# EAGLE design Waterbotboard (EAGLE 9.2.2)
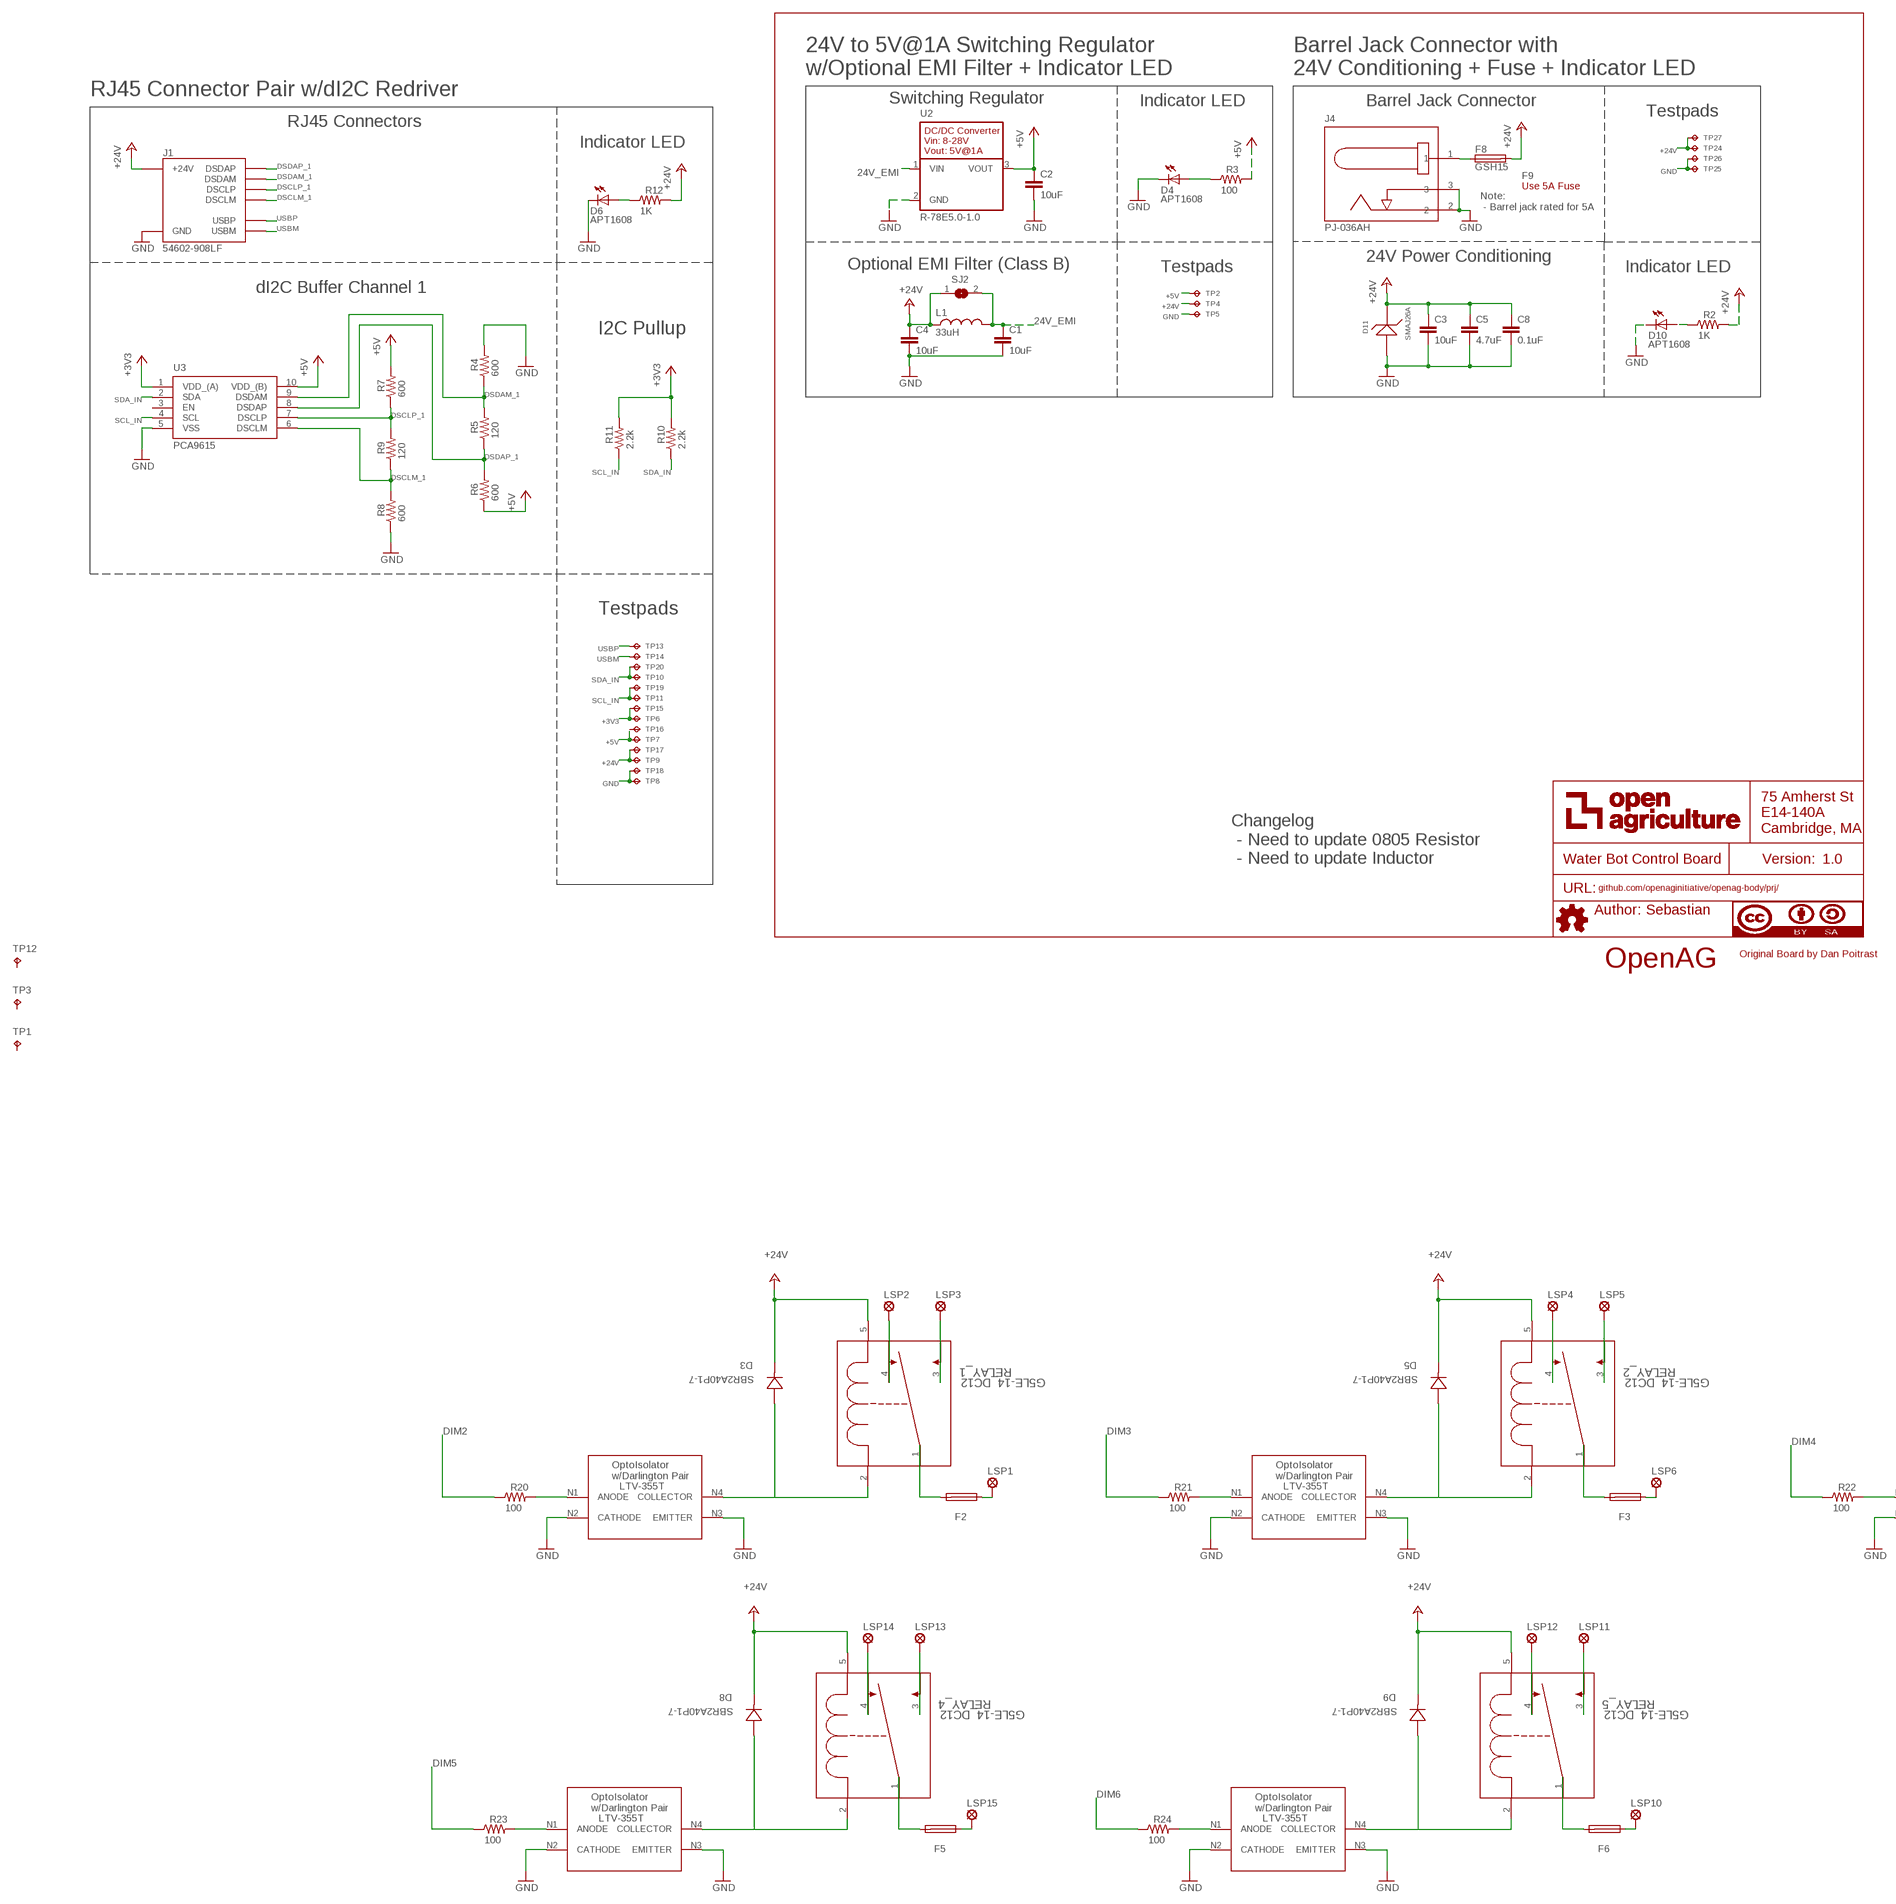
[diagram p0: schematic, sheet 1, part 1 of 2]
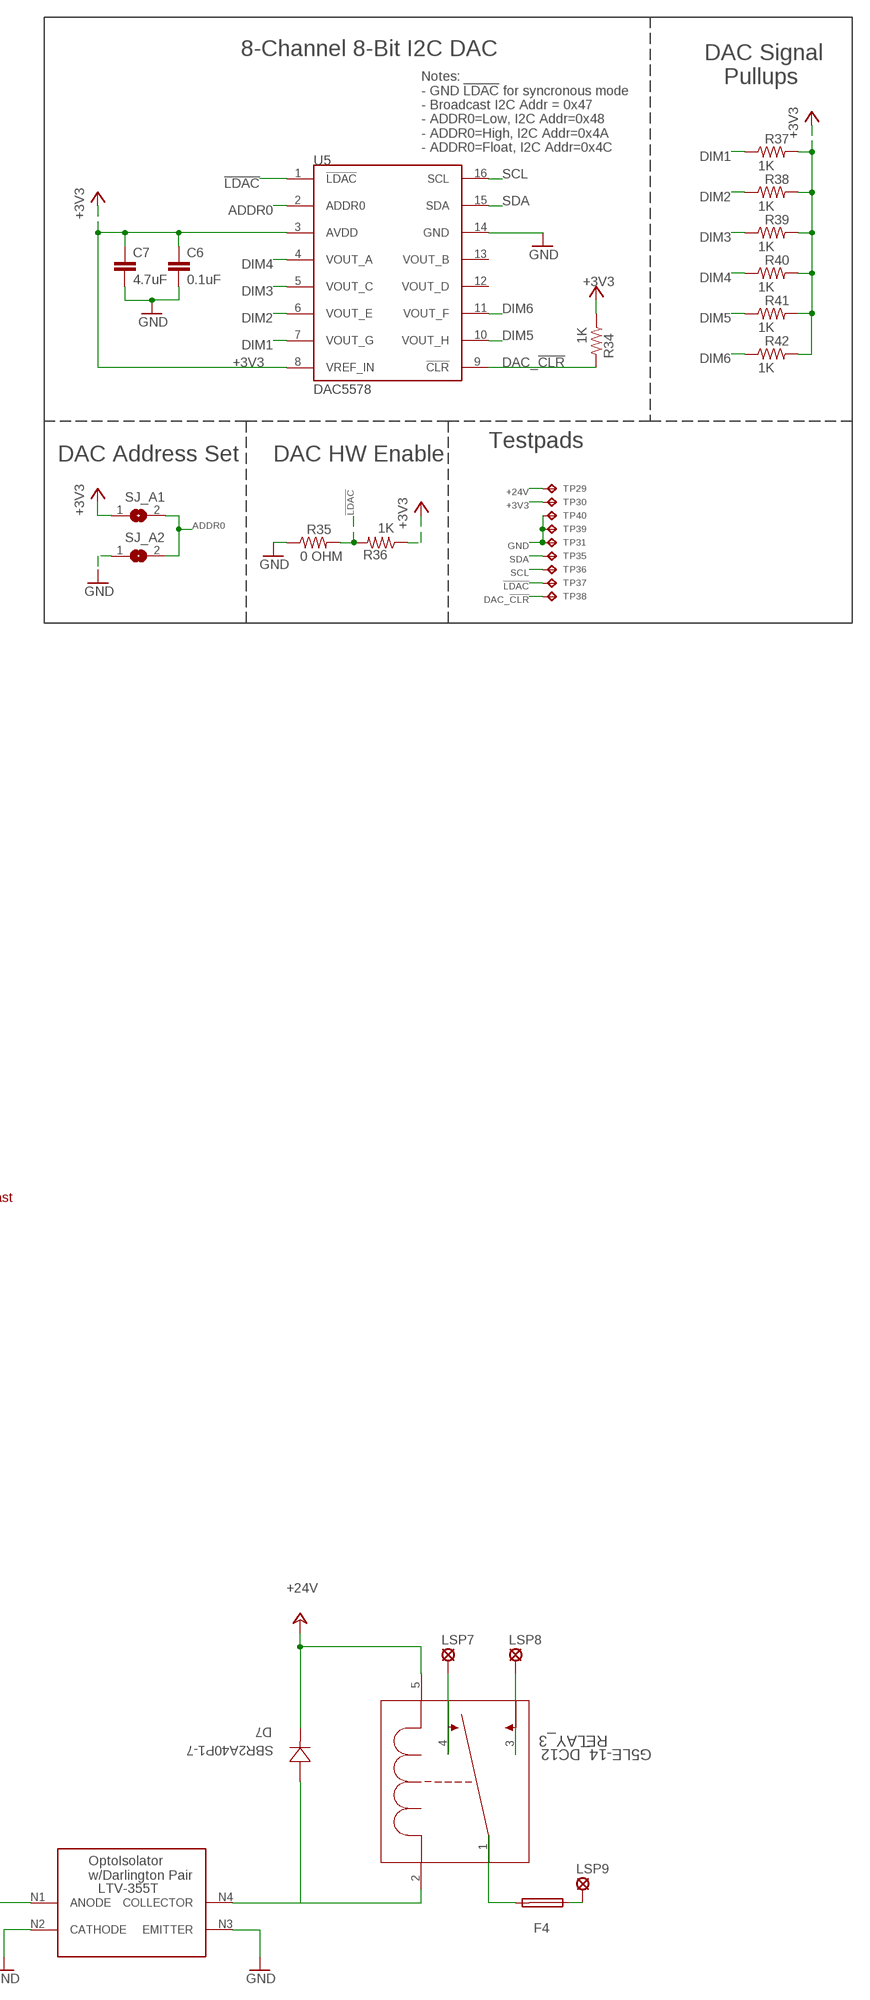
[diagram p1: schematic, sheet 1, part 2 of 2]

## Parts
C1  10uF  10UF-GMK212BBJ106KG-T  [C0805]
C2  10uF  10UF-GMK212BBJ106KG-T  [C0805]
C3  10uF  10UF-GMK212BBJ106KG-T  [C0805]
C4  10uF  10UF-GMK212BBJ106KG-T  [C0805]
C5  4.7uF  4.7UF-CL21A475KBQNNNE  [C0805]
C6  0.1uF  0.1UF-C0603C104K5RACTU  [C0603]
C7  4.7uF  4.7UF-CL21A475KBQNNNE  [C0805]
C8  0.1uF  0.1UF-C0603C104K5RACTU  [C0603]
D3  SBR2A40P1-7  [POWERDI123]
D4  APT1608  APT1608CGCK  [CHIPLED_0603]
D5  SBR2A40P1-7  [POWERDI123]
D6  APT1608  APT1608CGCK  [CHIPLED_0603]
D7  SBR2A40P1-7  [POWERDI123]
D8  SBR2A40P1-7  [POWERDI123]
D9  SBR2A40P1-7  [POWERDI123]
D10  APT1608  APT1608CGCK  [CHIPLED_0603]
D11  SMAJ26A  SMAJ26A-13-F  [SMA]
F2  GSH15  [GSH15]
F3  GSH15  [GSH15]
F4  GSH15  [GSH15]
F5  GSH15  [GSH15]
F6  GSH15  [GSH15]
F8  GSH15  [GSH15]
F9  Use 5A Fuse  0217005.MXP  [FUSE-CARTRIDGE]
J1  54602-908LF  RJ45-DI2C-USB-54602-908LFPTH  [RJ45-DI2C-USB-54602-908LF]
J4  PJ-036AH  BARREL-JACK-PJ-036AH-SMT-TR  [BARREL-JACK-PJ-036AH]
L1  33uH  33UH-29333C  [29333C]
LSP1  LSP13  [LSP13]
LSP2  LSP13  [LSP13]
LSP3  LSP13  [LSP13]
LSP4  LSP13  [LSP13]
LSP5  LSP13  [LSP13]
LSP6  LSP13  [LSP13]
LSP7  LSP13  [LSP13]
LSP8  LSP13  [LSP13]
LSP9  LSP13  [LSP13]
LSP10  LSP13  [LSP13]
LSP11  LSP13  [LSP13]
LSP12  LSP13  [LSP13]
LSP13  LSP13  [LSP13]
LSP14  LSP13  [LSP13]
LSP15  LSP13  [LSP13]
R2  1K  1K-ERJ-PB3D1001V  [RC0603N]
R3  100  100OHM-RC0603JR-07100RL  [RC0603N]
R4  600  600OHM-RC0603FR-07604RL  [RC0603N]
R5  120  120OHM-RC0603FR-07120RL  [RC0603N]
R6  600  600OHM-RC0603FR-07604RL  [RC0603N]
R7  600  600OHM-RC0603FR-07604RL  [RC0603N]
R8  600  600OHM-RC0603FR-07604RL  [RC0603N]
R9  120  120OHM-RC0603FR-07120RL  [RC0603N]
R10  2.2k  2.2K-RC0603JR-072K2L  [RC0603N]
R11  2.2k  2.2K-RC0603JR-072K2L  [RC0603N]
R12  1K  1K-ERJ-PB3D1001V  [RC0603N]
R20  100  100OHM-RC0603JR-07100RL  [RC0603N]
R21  100  100OHM-RC0603JR-07100RL  [RC0603N]
R22  100  100OHM-RC0603JR-07100RL  [RC0603N]
R23  100  100OHM-RC0603JR-07100RL  [RC0603N]
R24  100  100OHM-RC0603JR-07100RL  [RC0603N]
R34  1K  1K-ERJ-PB3D1001V  [RC0603N]
R35  0 OHM  0OHM-RC0603JR-070RL  [RC0603N]
R36  1K  1K-ERJ-PB3D1001V  [RC0603N]
R37  1K  1K-ERJ-PB3D1001V  [RC0603N]
R38  1K  1K-ERJ-PB3D1001V  [RC0603N]
R39  1K  1K-ERJ-PB3D1001V  [RC0603N]
R40  1K  1K-ERJ-PB3D1001V  [RC0603N]
R41  1K  1K-ERJ-PB3D1001V  [RC0603N]
R42  1K  1K-ERJ-PB3D1001V  [RC0603N]
RELAY_1  G5LE-14_DC12  [RELAY_G5LE-1]
RELAY_2  G5LE-14_DC12  [RELAY_G5LE-1]
RELAY_3  G5LE-14_DC12  [RELAY_G5LE-1]
RELAY_4  G5LE-14_DC12  [RELAY_G5LE-1]
RELAY_5  G5LE-14_DC12  [RELAY_G5LE-1]
SJ2  EMI-BYPASS  [EMI-BYPASS]
SJ_A1  SOLDERJUMPERREFLOW_NOPASTE  [SJ1]
SJ_A2  SOLDERJUMPERREFLOW_NOPASTE  [SJ1]
TP1  TPB2,54  [B2,54]
TP2  TPTP06R  [TP06R]
TP3  TPB2,54  [B2,54]
TP4  TPTP06R  [TP06R]
TP5  TPTP06R  [TP06R]
TP6  TPTP04R  [TP04R]
TP7  TPTP04R  [TP04R]
TP8  TPTP04R  [TP04R]
TP9  TPTP04R  [TP04R]
TP10  TPTP04R  [TP04R]
TP11  TPTP04R  [TP04R]
TP12  TPB2,54  [B2,54]
TP13  TPTP04R  [TP04R]
TP14  TPTP04R  [TP04R]
TP15  TPTP04R  [TP04R]
TP16  TPTP04R  [TP04R]
TP17  TPTP04R  [TP04R]
TP18  TPTP04R  [TP04R]
TP19  TPTP04R  [TP04R]
TP20  TPTP04R  [TP04R]
TP24  TPTP04R  [TP04R]
TP25  TPTP04R  [TP04R]
TP26  TPTP04R  [TP04R]
TP27  TPTP04R  [TP04R]
TP29  TPTP04R  [TP04R]
TP30  TPTP04R  [TP04R]
TP31  TPTP04R  [TP04R]
TP35  TPTP04R  [TP04R]
TP36  TPTP04R  [TP04R]
TP37  TPTP04R  [TP04R]
TP38  TPTP04R  [TP04R]
TP39  TPTP04R  [TP04R]
TP40  TPTP04R  [TP04R]
U2  R-78E5.0-1.0  [R-78E5.0-1.0]
U3  PCA9615  PCA9615DPJ  [SOP50P490X110-10N]
U5  DAC5578  DAC5578SPW  [TSSOP16]
U$6  AUTHOR  [AUTHOR]
U$7  TITLE  [TITLE]
U$10  LTV-355T  [LTV-355T]
U$11  LTV-355T  [LTV-355T]
U$12  LTV-355T  [LTV-355T]
U$13  LTV-355T  [LTV-355T]
U$14  LTV-355T  [LTV-355T]

## Nets
24V_EMI: C1.1 L1.2 SJ2.2 U2.1(VIN)
24V_IN1: F8.1 J4.1
!LDAC!: R35.2 R36.2 TP37.1(TP) U5.1(!LDAC!)
+3V3: C6.1 C7.1 R10.2 R11.2 R34.1 R36.1 R37.2 R38.2 R39.2 R40.2 R41.2 R42.2 SJ_A1.1 TP6.1(TP) TP15.1(TP) TP30.1(TP) U3.1(VDD_(A)) U5.3(AVDD) U5.8(VREF_IN)
+5V: C2.1 R3.2 R6.1 R7.2 TP2.TP TP7.1(TP) TP16.1(TP) U2.3(VOUT) U3.10(VDD_(B))
+24V: C3.1 C4.1 C5.1 C8.1 D3.- D5.- D7.- D8.- D9.- D11.1 F8.2 J1.24V(6)(+24V) L1.1 R2.2 R12.2 RELAY_1.5 RELAY_2.5 RELAY_3.5 RELAY_4.5 RELAY_5.5 SJ2.1 TP4.TP TP9.1(TP) TP17.1(TP) TP24.1(TP) TP27.1(TP) TP29.1(TP)
ADDR0: SJ_A1.2 SJ_A2.2 U5.2(ADDR0)
DAC_!CLR!: R34.2 TP38.1(TP) U5.9(!CLR!)
DIM1: R37.1 U5.7(VOUT_G)
DIM2: R20.1 R38.1 U5.6(VOUT_E)
DIM3: R21.1 R39.1 U5.5(VOUT_C)
DIM4: R22.1 R40.1 U5.4(VOUT_A)
DIM5: R23.1 R41.1 U5.10(VOUT_H)
DIM6: R24.1 R42.1 U5.11(VOUT_F)
DSCLM_1: J1.DSCLM(5)(DSCLM) R8.2 R9.1 U3.6(DSCLM)
DSCLP_1: J1.DSCLP(4)(DSCLP) R7.1 R9.2 U3.7(DSCLP)
DSDAM_1: J1.DSDAM(2)(DSDAM) R4.1 R5.2 U3.9(DSDAM)
DSDAP_1: J1.DSDAP(1)(DSDAP) R5.1 R6.2 U3.8(DSDAP)
GND: C1.2 C2.2 C3.2 C4.2 C5.2 C6.2 C7.2 C8.2 D4.C D6.C D10.C D11.2 J1.GND(3)(GND) J4.2 J4.3 R4.2 R8.1 R35.1 SJ_A2.1 TP5.TP TP8.1(TP) TP18.1(TP) TP25.1(TP) TP26.1(TP) TP31.1(TP) TP39.1(TP) TP40.1(TP) U2.2(GND) U3.5(VSS) U5.14(GND) U$10.N2(CATHODE) U$10.N3(EMITTER) U$11.N2(CATHODE) U$11.N3(EMITTER) U$12.N2(CATHODE) U$12.N3(EMITTER) U$13.N2(CATHODE) U$13.N3(EMITTER) U$14.N2(CATHODE) U$14.N3(EMITTER)
N$4: F2.1 LSP1.MP
N$5: F5.1 LSP15.MP
N$6: F6.1 LSP10.MP
N$7: F3.1 LSP6.MP
N$11: F4.1 LSP9.MP
N$27: LSP2.MP RELAY_1.4
N$31: LSP4.MP RELAY_2.4
N$32: LSP7.MP RELAY_3.4
N$33: D4.A R3.1
N$42: D3.+ RELAY_1.2 U$10.N4(COLLECTOR)
N$43: D6.A R12.1
N$44: F2.2 RELAY_1.1
N$45: LSP3.MP RELAY_1.3
N$46: LSP12.MP RELAY_5.4
N$47: R20.2 U$10.N1(ANODE)
N$48: D5.+ RELAY_2.2 U$11.N4(COLLECTOR)
N$49: F3.2 RELAY_2.1
N$50: LSP5.MP RELAY_2.3
N$51: LSP14.MP RELAY_4.4
N$52: R21.2 U$11.N1(ANODE)
N$53: D7.+ RELAY_3.2 U$12.N4(COLLECTOR)
N$54: F4.2 RELAY_3.1
N$55: LSP8.MP RELAY_3.3
N$57: R22.2 U$12.N1(ANODE)
N$58: D8.+ RELAY_4.2 U$13.N4(COLLECTOR)
N$59: F5.2 RELAY_4.1
N$60: LSP13.MP RELAY_4.3
N$61: D10.A R2.1
N$62: R23.2 U$13.N1(ANODE)
N$63: D9.+ RELAY_5.2 U$14.N4(COLLECTOR)
N$64: F6.2 RELAY_5.1
N$65: LSP11.MP RELAY_5.3
N$67: R24.2 U$14.N1(ANODE)
SCL: TP36.1(TP) U5.16(SCL)
SCL_IN: R11.1 TP11.1(TP) TP19.1(TP) U3.4(SCL)
SDA: TP35.1(TP) U5.15(SDA)
SDA_IN: R10.1 TP10.1(TP) TP20.1(TP) U3.2(SDA)
USBM: J1.USBM(8)(USBM) TP14.1(TP)
USBP: J1.USBP(7)(USBP) TP13.1(TP)
Unconnected: TP1.TP TP3.TP TP12.TP U3.3(EN) U5.12(VOUT_D) U5.13(VOUT_B)

## Notes on the sheet
- 8-Channel 8-Bit I2C DAC
- 24V to 5V@1A Switching Regulator
  w/Optional EMI Filter + Indicator LED
- Barrel Jack Connector with
  24V Conditioning + Fuse + Indicator LED
- RJ45 Connector Pair w/dI2C Redriver
- DAC Signal 
     Pullups
- Switching Regulator | Indicator LED | Barrel Jack Connector
- Testpads
- RJ45 Connectors
- Indicator LED
- Notes:
  - GND !LDAC! for syncronous mode
  - Broadcast I2C Addr = 0x47
  - ADDR0=Low, I2C Addr=0x48
  - ADDR0=High, I2C Addr=0x4A
  - ADDR0=Float, I2C Addr=0x4C
- Note:
   - Barrel jack rated for 5A
- 24V Power Conditioning
- Optional EMI Filter (Class B) | Testpads | Indicator LED
- dI2C Buffer Channel 1
- I2C Pullup
- Testpads
- DAC Address Set | DAC HW Enable
- Testpads
- Changelog
   - Need to update 0805 Resistor
   - Need to update Inductor
- Original Board by Dan Poitrast
- OpenAG
- LTV-355T | LTV-355T | LTV-355T
- LTV-355T | LTV-355T

## Library data of the parts
C1-C4 = openag-capacitors:10UF-GMK212BBJ106KG-T: CAP CER 10UF 35V X5R 0805 Description: 10µF ±10% 35V Ceramic Capacitor X5R 0805 (2012 Metric) Technical Specifications: Capacitance: 10µF Tolerance: ±10% Rated Voltage: 35V Temperature Coefficient: X5R Operating Temperature: -55°C ~ 85°C Package / Case: 0805 (2012 Metric) Datasheet(s): GMK212BBJ106KG-T Spec <http://ds.yuden.co.jp/TYCOMPAS/ut/detail.do?productNo=GMK212BBJ106KG-T&fileName=GMK212BBJ106KG-T_SS&mode=specSheetDownload> Vendor(s): Digikey: 587-4893-1-ND <https://www.digikey.com/product-detail/en/taiyo-yuden/GMK212BBJ106KG-T/587-4893-1-ND/6563736>; MANUFACTURER: Taiyo Yuden; MPN: GMK212BBJ106KG-T; VENDOR: Digikey; VLINK: https://www.digikey.com/product-detail/en/taiyo-yuden/GMK212BBJ106KG-T/587-4893-1-ND/6563736; VPN: 587-4893-1-ND
C5 C7 = openag-capacitors:4.7UF-CL21A475KBQNNNE: CAP CER 4.7UF 50V X5R 0805 Description: 4.7µF ±10% 50V Ceramic Capacitor X5R 0805 (2012 Metric) Technical Specifications: Capacitance: 4.7uF Tolerance: ±10% Rated Voltage: 50V Temperature Coefficient: X5R Operating Temperature: -55°C ~ 85°C Package/Case: 0805 (2012 Metric) Datasheet(s): CL21A475KBQNNNE Characteristics <http://www.samsungsem.com/kr/front/downloadcms.do?path=/kr/support/product-search/mlcc/__icsFiles/afieldfile/2014/11/05&fileName=C_CL21A475KBQNNNE.pdf> Vendor(s): Digikey: 1276-1248-1-ND <https://www.digikey.com/product-detail/en/samsung-electro-mechanics/CL21A475KBQNNNE/1276-1248-1-ND/3889334>; MANUFACTURER: Samsung; MPN: CL21A475KBQNNNE; VENDOR: Digikey; VLINK: https://www.digikey.com/product-detail/en/samsung-electro-mechanics/CL21A475KBQNNNE/1276-1248-1-ND/3889334; VPN: 1276-1248-1-ND
C6 C8 = openag-capacitors:0.1UF-C0603C104K5RACTU: CAP CER 0.1UF 50V X7R 0603 Description: 0.1µF ±10% 50V Ceramic Capacitor X7R 0603 (1608 Metric) Technical Specifications: Capacitance: 0.1µF Tolerance: ±10% Rated Voltage: 50V Temperature Coefficient: X7R Operating Temperature: -55°C ~ 125°C Package / Case: 0603 (1608 Metric) Datasheet(s): X7R Dielectric, 6.3-250 VDC <https://search.kemet.com/component-edge/download/datasheet/C0603C104K5RACTU.pdf> Vendor(s): Digikey: 399-5089-1-ND <https://www.digikey.com/product-detail/en/kemet/C0603C104K5RACTU/399-5089-1-ND/1465623>; MANUFACTURER: Kemet; MPN: C0603C104K5RACTU; VENDOR: Digikey; VLINK: https://www.digikey.com/product-detail/en/kemet/C0603C104K5RACTU/399-5089-1-ND/1465623; VPN: 399-5089-1-ND
D3 D5 D7-D9 = openag-diodes:SBR2A40P1-7: DIODE SBR 40V 2A POWERDI123 Description: Diode Super Barrier 40V 2A Surface Mount PowerDI™ 123 Technical Specifications: Diode Type: Super Barrier Voltage - DC Reverse (Vr) (Max): 40V Current - Average Rectified (Io): 2A Voltage - Forward (Vf) (Max) @ If: 500mV @ 2A Speed: Standard Recovery >500ns, > 200mA (Io) Current - Reverse Leakage @ Vr: 100µA @ 40V Mounting Type: Surface Mount Package / Case: POWERDI®123 Supplier Device Package: PowerDI™ 123 Operating Temperature - Junction: -65°C ~ 150°C Base Part Number: SBR2A40 Datasheet(s): SBR2A40P1 <https://www.diodes.com/assets/Datasheets/SBR2A40P1.pdf> Vendor(s): Digikey: SBR2A40P1DITR-ND <https://www.digikey.com/product-detail/en/diodes-incorporated/SBR2A40P1-7/SBR2A40P1DITR-ND/1681825>; MANUFACTURER: Diodes Incorporated; MPN: SBR2A40P1-7; VENDOR: Digikey; VLINK: https://www.digikey.com/product-detail/en/diodes-incorporated/SBR2A40P1-7/SBR2A40P1DITR-ND/1681825; VPN: SBR2A40P1DITR-ND
D4 D6 D10 = openag-diodes:APT1608CGCK: LED GREEN CLEAR 0603 SMD Description: Green 570nm LED Indication - Discrete 2.1V 0603 (1608 Metric) Technical Specifications: Color: Green Lens Color: Colorless Lens Transparency: Clear Millicandela Rating: 50mcd Lens Style/Size: Rectangle with Flat Top, 1.20mm x 0.80mm Voltage - Forward (Vf) (Typ): 2.1V Current - Test: 20mA Viewing Angle: 120° Mounting Type: Surface Mount Wavelength - Dominant: 570nm Wavelength - Peak: 574nm Package / Case: 0603 (1608 Metric) Supplier Device Package: Chip LED Size / Dimension: 1.60mm L x 0.80mm W Height (Max): 0.75mm Datasheet(s): APT1608CGCK <http://www.kingbrightusa.com/images/catalog/SPEC/APT1608CGCK.pdf> Vendor(s): Digikey: 754-1116-1-ND <https://www.digikey.com/product-detail/en/kingbright/APT1608CGCK/754-1116-1-ND/1747833#>; MANUFACTURER: Kingbright; MPN: APT1608CGCK; VENDOR: Digikey; VLINK: https://www.digikey.com/product-detail/en/kingbright/APT1608CGCK/754-1116-1-ND/1747833#; VPN: 754-1116-1-ND
D11 = openag-diodes:SMAJ26A-13-F: TVS DIODE 26VWM 42.1VC SMA Description: TVS DIODE 26VWM 42.1VC SMA Technical Specifications: Type: Zener Voltage - Reverse Standoff (Typ): 26V Voltage - Breakdown (Min): 28.9V Voltage - Clamping (Max) @ Ipp: 42.1V Current - Peak Pulse (10/1000µs): 9.5A Power - Peak Pulse: 400W Power Line Protection: No Operating Temperature: -55°C ~ 150°C (TJ) DO-214AC, SMA Datasheet(s): SMAJ5.0(C)A - SMAJ200(C)A Vendor(s): Digikey: SMAJ26A-FDICT-ND <https://www.digikey.com/product-detail/en/diodes-incorporated/SMAJ26A-13-F/SMAJ26A-FDICT-ND/806583>; MANUFACTURER: Diodes Incorporated; MPN: SMAJ26A-13-F; VENDOR: Digikey; VLINK: https://www.digikey.com/product-detail/en/diodes-incorporated/SMAJ26A-13-F/SMAJ26A-FDICT-ND/806583; VPN: SMAJ26A-FDICT-ND
F2-F6 = fuse:GSH15: FUSE HOLDER grid 15mm, 19649 Wickmann; MPN: 64900001039; OC_FARNELL: 1271673; OC_NEWARK: 02P0318
F8 = openag-fuses:GSH15: FUSE BLOCK CART 250V 6.3A PCB Description: Fuse Block 6.3A 250V 1 Circuit Cartridge PCB Technical Specifications: Fuseholder Type: Block Fuse Type: Cartridge For Use With/Related Products: 5mm x 20mm Fuse Size: 5mm x 20mm Number of Circuits: 1 Voltage: 250V Current Rating: 6.3A Mounting Type: PCB Orientation: Horizontal Termination Style: PC Pin Contact Material: Copper Alloy Contact Finish: Tin Datasheet(s): 649 Series <http://www.littelfuse.com/~/media/electronics/datasheets/fuse_blocks/littelfuse_fuse_block_649_datasheet.pdf.pdf> Vendor(s): Digikey: WK0011-ND <https://www.digikey.com/product-detail/en/littelfuse-inc/64900001039/WK0011-ND/245470>; MANUFACTURER: Littelfuse Inc.; MPN: 64900001039; VENDOR: Digikey; VLINK: https://www.digikey.com/product-detail/en/littelfuse-inc/64900001039/WK0011-ND/245470; VPN: WK0011-ND
F9 = openag-fuses:0217005.MXP: FUSE GLASS 5A 250VAC 5X20MM Description: FUSE GLASS 5A 250VAC 5X20MM Technical Specifications: Fuse Type: Cartridge, Glass Current Rating: 5A Voltage Rating - AC: 250V Response Time: Fast Package / Case: 5mm x 20mm Mounting Type: Holder Breaking Capacity @ Rated Voltage: 50A Melting I²t: 42.795 Approvals: BSI, CE, CCC, CSA, KC, PSE, SEMKO, UR, VDE Operating Temperature: -55°C ~ 125°C Size / Dimension: 0.205" Dia x 0.787" L (5.20mm x 20.00mm) DC Cold Resistance: 0.0137 Ohms Datasheet(s): 217 Series Datasheet <http://www.littelfuse.com/~/media/electronics/datasheets/fuses/littelfuse_fuse_217_datasheet.pdf.pdf> Vendor(s): Digikey: F1725-ND <https://www.digikey.com/product-detail/en/littelfuse-inc/0217005.MXP/F1725-ND/777549#>; MANUFACTURER: Littelfuse Inc.; MPN: 0217005.MXP; VENDOR: Digikey; VLINK: https://www.digikey.com/product-detail/en/littelfuse-inc/0217005.MXP/F1725-ND/777549; VPN: F1725-ND
J1 = openag-connectors:RJ45-DI2C-USB-54602-908LF: CONN MOD JACK 8P8C R/A UNSHLD Description: Jack Modular Connector 8p8c (RJ45, Ethernet) 90° Angle (Right) Unshielded Cat3 Technical Specifications: Connector Type: Jack Number of Positions/Contacts: 8p8c (RJ45, Ethernet) Number of Ports: 1 Number of Rows: 1 Mounting Type: Through Hole Orientation: 90° Angle (Right) Termination: Solder Shielding: Unshielded Ratings: Cat3 Features: Board Lock LED Color: Does Not Contain LED Tab Direction: Down Contact Material: Copper Alloy Contact Finish: Gold Contact Finish Thickness: 15µin (0.38µm) Housing Material: Polyester, Glass Filled Operating Temperature: -40°C ~ 70°C Datasheet(s): 54601-x04(zzz)WPLF Drawing <http://cdn.amphenol-icc.com/media/wysiwyg/files/drawing/c-bmj-0102.pdf> Vendor(s): Digikey: 609-1046-ND <https://www.digikey.com/product-detail/en/amphenol-fci/54602-908LF/609-1046-ND/1001360>; MANUFACTURER: Amphenol FCI; MPN: 54602-908LF; VENDOR: Digikey; VLINK: https://www.digikey.com/product-detail/en/amphenol-fci/54602-908LF/609-1046-ND/1001360; VPN: 609-1046-ND
J4 = openag-connectors:BARREL-JACK-PJ-036AH-SMT-TR: CONN PWR JACK 2X5.5MM SOLDER Description: Power Barrel Connector Jack 2.10mm ID (0.083"), 5.50mm OD (0.217") Surface Mount, Right Angle Technical Specifications: Connector Type: Jack Gender: Male Industry Recognized Mating Diameter: 2.10mm ID (0.083"), 5.50mm OD (0.217") Actual Diameter: 0.078" (2.00mm ID), 0.248" (6.30mm OD) Number of Positions/Contacts: 2 Conductors, 3 Contacts Internal Switch(s): Single Switch, Normally Closed Mounting Type: Surface Mount, Right Angle Termination: Solder Shielding: Unshielded Voltage - Rated: 24VDC Current Rating: 5A Mating Length/Depth: 0.360" (9.15mm) Contact Material - Plating: Silver Operating Temperature: -25°C ~ 85°C Housing Material: Polyamide (PA6T), Nylon 6T Contact Material: Brass; Copper Alloy Body Color: Black Datasheet(s): PJ-036AH-SMT-TR <http://www.cui.com/product/resource/digikeypdf/pj-036ah-smt-tr.pdf> Vendor(s): Digikey: CP-036AHPJCT-ND <https://www.digikey.com/product-detail/en/cui-inc/PJ-036AH-SMT-TR/CP-036AHPJCT-ND/1530994>; MANUFACTURER: CUI Inc.; MPN: PJ-036AH-SMT-TR; VENDOR: Digikey; VLINK: https://www.digikey.com/product-detail/en/cui-inc/PJ-036AH-SMT-TR/CP-036AHPJCT-ND/1530994; VPN: CP-036AHPJCT-ND
L1 = openag-inductors:33UH-29333C: FIXED IND 33UH 1A 120 MOHM SMD Description: 33µH Shielded Wirewound Inductor 1A 120 mOhm Max Nonstandard Technical Specifications: Type: Wirewound Inductance: 33µH Current Rating: 1A Shielding: Shielded DC Resistance (DCR): 120 mOhm Max Operating Temperature: -40°C ~ 85°C Frequency - Test: 10kHz Mounting Type: Surface Mount Package / Case: Nonstandard Size / Dimension: 0.283" L x 0.283" W (7.20mm x 7.20mm) Height - Seated (Max): 0.157" (4.00mm) Datasheet(s): 2900 Series <https://www.murata-ps.com/data/magnetics/kmp_2900.pdf> Vendor(s): Digikey: 811-1138-1-ND <https://www.digikey.com/product-detail/en/murata-power-solutions-inc/29333C/811-1138-1-ND/1924860>; MANUFACTURER: Murata Power Solutions Inc.; MPN: 29333C; VENDOR: Digikey; VLINK: https://www.digikey.com/product-detail/en/murata-power-solutions-inc/29333C/811-1138-1-ND/1924860; VPN: 811-1138-1-ND
LSP1-LSP15 = solpad:LSP13: SOLDER PAD drill 1.3 mm, distributor Buerklin, 12H562
R2 R12 R34 R36-R42 = openag-resistors:1K-ERJ-PB3D1001V: RES SMD 1K OHM 0.5% 1/5W 0603 Description: 1 kOhms ±0.5% 0.2W, 1/5W Chip Resistor 0603 (1608 Metric) Automotive AEC-Q200, Pulse Withstanding Thick Film Technical Specifications: Resistance: 1 kOhms Tolerance: ±0.5% Power: 0.2W, 1/5W Operating Temperature: -55°C ~ 155°C Package / Case: 0603 (1608 Metric) Datasheet(s): ERJ-PB3, PB6 Series, High Precision Datasheet <https://industrial.panasonic.com/cdbs/www-data/pdf/RDM0000/AOA0000C328.pdf> Vendor(s): Digikey: P20283CT-ND <https://www.digikey.com/product-detail/en/panasonic-electronic-components/ERJ-PB3D1001V/P20283CT-ND/6214538>; MANUFACTURER: Panasonic; MPN: P20283CT-ND; VENDOR: Digikey; VLINK: https://www.digikey.com/product-detail/en/panasonic-electronic-components/ERJ-PB3D1001V/P20283CT-ND/6214538; VPN: P20283CT-ND
R3 R20-R24 = openag-resistors:100OHM-RC0603JR-07100RL: RES SMD 100 OHM 5% 1/10W 0603 Description: 100 Ohms ±5% 0.1W, 1/10W Chip Resistor 0603 (1608 Metric) Moisture Resistant Thick Film Technical Specifications: Resistance: 100 Ohms Tolerance: ±5% Power (Watts): 0.1W, 1/10W Composition: Thick Film Features: Moisture Resistant Temperature Coefficient: ±100ppm/°C Operating Temperature: -55°C ~ 155°C Package / Case: 0603 (1608 Metric) Supplier Device Package: 0603 Size / Dimension: 0.063" L x 0.032" W (1.60mm x 0.80mm) Height - Seated (Max): 0.022" (0.55mm) Number of Terminations: 2 Datasheet(s): Thick Film Chip Resistor Intro <http://www.yageo.com.tw/exep/pages/download/literatures/PYu-R_INT-thick_7.pdf> Chip Resistor Marking <http://www.yageo.com/exep/pages/download/literatures/PYu-R_Marking_2.pdf> RC Series, L Datasheet <http://www.yageo.com/documents/recent/PYu-RC_Group_51_RoHS_L_8.pdf> Vendor(s): Digikey: 311-100GRCT-ND <https://www.digikey.com/product-detail/en/yageo/RC0603JR-07100RL/311-100GRCT-ND/729644>; MANUFACTURER: Yageo; MPN: RC0603JR-07100RL; VENDOR: Digikey; VLINK: https://www.digikey.com/product-detail/en/yageo/RC0603JR-07100RL/311-100GRCT-ND/729644; VPN: 311-100GRCT-ND
R4 R6-R8 = openag-resistors:600OHM-RC0603FR-07604RL: RES SMD 604 OHM 1% 1/10W 0603 Description: 604 Ohms ±1% 0.1W, 1/10W Chip Resistor 0603 (1608 Metric) Moisture Resistant Thick Film Technical Specifications: Resistance: 604 Ohms Tolerance: ±1% Power (Watts): 0.1W, 1/10W Composition: Thick Film Features: Moisture Resistant Temperature Coefficient: ±100ppm/°C Operating Temperature: -55°C ~ 155°C Package / Case: 0603 (1608 Metric) Supplier Device Package: 0603 Size / Dimension: 0.063" L x 0.032" W (1.60mm x 0.80mm) Height - Seated (Max): 0.022" (0.55mm) Number of Terminations: 2 Datasheet(s): RC Series, L Datasheet <http://www.yageo.com/documents/recent/PYu-RC_Group_51_RoHS_L_8.pdf> Chip Resistor Marking <http://www.yageo.com/exep/pages/download/literatures/PYu-R_Marking_2.pdf> Vendor(s): Digikey: 311-604HRCT-ND <https://www.digikey.com/product-detail/en/yageo/RC0603FR-07604RL/311-604HRCT-ND/730276>; MANUFACTURER: Yageo; MPN: RC0603FR-07604RL; VENDOR: Digikey; VLINK: https://www.digikey.com/product-detail/en/yageo/RC0603FR-07604RL/311-604HRCT-ND/730276; VPN: 311-604HRCT-ND
R5 R9 = openag-resistors:120OHM-RC0603FR-07120RL: RES SMD 120 OHM 1% 1/10W 0603 Description: 120 Ohms ±1% 0.1W, 1/10W Chip Resistor 0603 (1608 Metric) Moisture Resistant Thick Film Technical Specifications: Resistance: 120 Ohms Tolerance: ±1% Power (Watts): 0.1W, 1/10W Composition: Thick Film Features: Moisture Resistant Temperature Coefficient: ±100ppm/°C Operating Temperature: -55°C ~ 155°C Package / Case: 0603 (1608 Metric) Supplier Device Package: 0603 Size / Dimension: 0.063" L x 0.032" W (1.60mm x 0.80mm) Height - Seated (Max): 0.022" (0.55mm) Number of Terminations: 2 Datasheet(s): RC Series, L Datasheet <http://www.yageo.com/documents/recent/PYu-RC_Group_51_RoHS_L_8.pdf> Chip Resistor Marking <http://www.yageo.com/exep/pages/download/literatures/PYu-R_Marking_2.pdf> Vendor(s): Digikey: 311-120HRCT-ND <https://www.digikey.com/product-detail/en/yageo/RC0603FR-07120RL/311-120HRCT-ND/729867>; MANUFACTURER: Yageo; MPN: RC0603FR-07120RL; VENDOR: Digikey; VLINK: https://www.digikey.com/product-detail/en/yageo/RC0603FR-07120RL/311-120HRCT-ND/729867; VPN: 311-120HRCT-ND
R10 R11 = openag-resistors:2.2K-RC0603JR-072K2L: RES SMD 2.2K OHM 5% 1/10W 0603 Description: 2.2 kOhms ±5% 0.1W, 1/10W Chip Resistor 0603 (1608 Metric) Moisture Resistant Thick Film Technical Specifications: Resistance: 2.2 kOhms Tolerance: ±5% Power (Watts): 0.1W, 1/10W Composition: Thick Film Features: Moisture Resistant Temperature Coefficient: ±100ppm/°C Operating Temperature: -55°C ~ 155°C Package / Case: 0603 (1608 Metric) Supplier Device Package: 0603 Size / Dimension: 0.063" L x 0.032" W (1.60mm x 0.80mm) Height - Seated (Max): 0.022" (0.55mm) Number of Terminations: 2 Datasheet(s): RC Series, L Datasheet <http://www.yageo.com/documents/recent/PYu-RC_Group_51_RoHS_L_8.pdf> Chip Resistor Marking <http://www.yageo.com/exep/pages/download/literatures/PYu-R_Marking_2.pdf> Vendor(s): Digikey: 311-2.2KGRCT-ND <https://www.digikey.com/product-detail/en/yageo/RC0603JR-072K2L/311-2.2KGRCT-ND/729676#>; MANUFACTURER: Yageo; MPN: RC0603JR-072K2L; VENDOR: Digikey; VLINK: https://www.digikey.com/product-detail/en/yageo/RC0603JR-072K2L/311-2.2KGRCT-ND/729676#; VPN: 311-2.2KGRCT-ND
R35 = openag-resistors:0OHM-RC0603JR-070RL: RES SMD 0 OHM JUMPER 1/10W 0603 Description: 0 Ohms Jumper 0.1W, 1/10W Chip Resistor 0603 (1608 Metric) Moisture Resistant Thick Film Technical Specifications: Resistance: 0 Ohms Power: 0.1W, 1/10W Operating Temperature: -55°C ~ 155°C Package / Case: 0603 (1608 Metric) Datasheet(s): RC Series, L Datasheet <http://www.yageo.com/documents/recent/PYu-RC_Group_51_RoHS_L_8.pdf> Vendor(s): Digikey: 311-0.0GRCT-ND <https://www.digikey.com/product-detail/en/yageo/RC0603JR-070RL/311-0.0GRCT-ND/729622>; MANUFACTURER: Yageo; MPN: RC0603JR-070RL; VENDOR: Digikey; VLINK: https://www.digikey.com/product-detail/en/yageo/RC0603JR-070RL/311-0.0GRCT-ND/729622; VPN: 311-0.0GRCT-ND
RELAY_1-RELAY_5 = relay_2:G5LE-14_DC12; MANUFACTURER_PART_NUMBER: G5LE14 DC12; VENDOR: OMRON
SJ2 = openag-connectors:EMI-BYPASS: EMI Bypass Solder Jumper; MPN: N/A
SJ_A1 SJ_A2 = openag-connectors:SOLDERJUMPER: SMD Solder JUMPER Solder the two pads together to create a connection, or remove the solder to break it. REFLOW - Use this footprint for solder paste and reflow ovens. WAVE - Use this footprint for hand-soldering (larger pads). CLOSED - Has a trace between the two pads to ensure it is closed by default. The trace needs to be cut to disable the jumper, and can be closed again by creating a solder bridge between the two pads.; MPN: N/A
TP1 TP3 TP12 = testpad:TP: Test pad
TP2 TP4-TP11 TP13-TP20 TP24-TP27 TP29-TP31 TP35-TP40 = openag-testpads:TP: Test pad; MPN: N/A
U2 = openag-regulators:R-78E5.0-1.0: DC/DC CONVERTER 5V 5W Description: Linear Regulator Replacement DC DC Converter 1 Output 5V 1A 8V - 28V Input Technical Specifications: Type: Linear Regulator Replacement Number of Outputs: 1 Voltage - Input (Min): 8V Voltage - Input (Max): 28V Voltage - Output 1: 5V Current - Output (Max): 1A Power (Watts): 5W Applications: ITE (Commercial) Features: SCP Operating Temperature: -40°C ~ 85°C Efficiency: 91% Mounting Type: Through Hole Package / Case: 3-SIP Module Size / Dimension: 0.46" L x 0.33" W x 0.41" H (11.6mm x 8.5mm x 10.4mm) Datasheet(s): R-78E-1.0 Series Datasheet <https://www.recom-power.com/pdf/Innoline/R-78Exx-1.0.pdf> Vendor(s): Digikey: 945-2201-ND <https://www.digikey.com/product-detail/en/recom-power/R-78E5.0-1.0/945-2201-ND/4930585>; MANUFACTURER: Recom Power; MPN: R-78E5.0-1.0; VENDOR: Digikey; VLINK: https://www.digikey.com/product-detail/en/recom-power/R-78E5.0-1.0/945-2201-ND/4930585; VPN: 945-2201-ND
U3 = openag-buffers:PCA9615DPJ: IC REDRIVER I2C 2CH 10TSSOP Description: Buffer, ReDriver 2 Channel 400kHz 10-TSSOP Technical Specifications: Type: Buffer, ReDriver Applications: I²C Input: 2-Wire Bus Output: 2-Wire Bus Data Rate (Max): 400kHz Number of Channels: 2 Capacitance - Input: 7pF Voltage - Supply: 2.3 V ~ 5.5 V Current - Supply: 16µA Operating Temperature: -40°C ~ 85°C Package / Case: 10-TFSOP, 10-MSOP (0.118", 3.00mm Width) Supplier Device Package: 10-TSSOP Base Part Number: PCA9615 Datasheet(s): PCA9615DP <http://www.nxp.com/documents/data_sheet/PCA9615.pdf> Vendor(s): Digikey: 568-11484-1-ND <https://www.digikey.com/product-detail/en/nxp-usa-inc/PCA9615DPJ/568-11484-1-ND/4864508>; MANUFACTURER: NXP USA Inc.; MPN: PCA9615DPJ; VENDOR: Digikey; VLINK: https://www.digikey.com/product-detail/en/nxp-usa-inc/PCA9615DPJ/568-11484-1-ND/4864508; VPN: 568-11484-1-ND
U5 = openag-dacs:DAC5578SPW: IC DAC 8BIT I2C OCTAL 16TSSOP Description: 8 Bit Digital to Analog Converter 8 16-TSSOP Technical Specifications: Number of Bits: 8 Number of D/A Converters: 8 Settling Time: 12µs (Typ) Output Type: Voltage - Buffered Differential Output: No Data Interface: I²C Reference Type: External Voltage - Supply, Analog: 2.7 V ~ 5.5 V Voltage - Supply, Digital: 2.7 V ~ 5.5 V INL/DNL (LSB): ±0.01, ±0.01 Architecture: String DAC Operating Temperature: -40°C ~ 125°C Package / Case: 16-TSSOP (0.173", 4.40mm Width) Supplier Device Package: 16-TSSOP Base Part Number: DAC5578 Datasheet(s): DAC5578,6578,7578 <http://www.ti.com/lit/ds/symlink/dac5578.pdf> Analog Signal Chain Guide <http://www.ti.com/lit/pdf/slyb174> Vendor(s): Digikey: 296-27736-5-ND <https://www.digikey.com/product-detail/en/texas-instruments/DAC5578SPW/296-27736-5-ND/2360827>; MANUFACTURER: Texas Instruments; MPN: DAC5578SPW; VENDOR: Digikey; VLINK: https://www.digikey.com/product-detail/en/texas-instruments/DAC5578SPW/296-27736-5-ND/2360827; VPN: 296-27736-5-ND
U$6 = openag-frames:AUTHOR; AUTHOR: Sebastian; MPN: N/A
U$7 = openag-frames:TITLE; MPN: N/A; TITLE: Water Bot Control Board; URL: github.com/openaginitiative/openag-body/prj/; VER: 1.0
U$10-U$14 = openag-transistors:LTV-355T

## Net classes
0 default: width 0.305 mm, drill 0.254 mm, clearance 0.254 mm

## Board
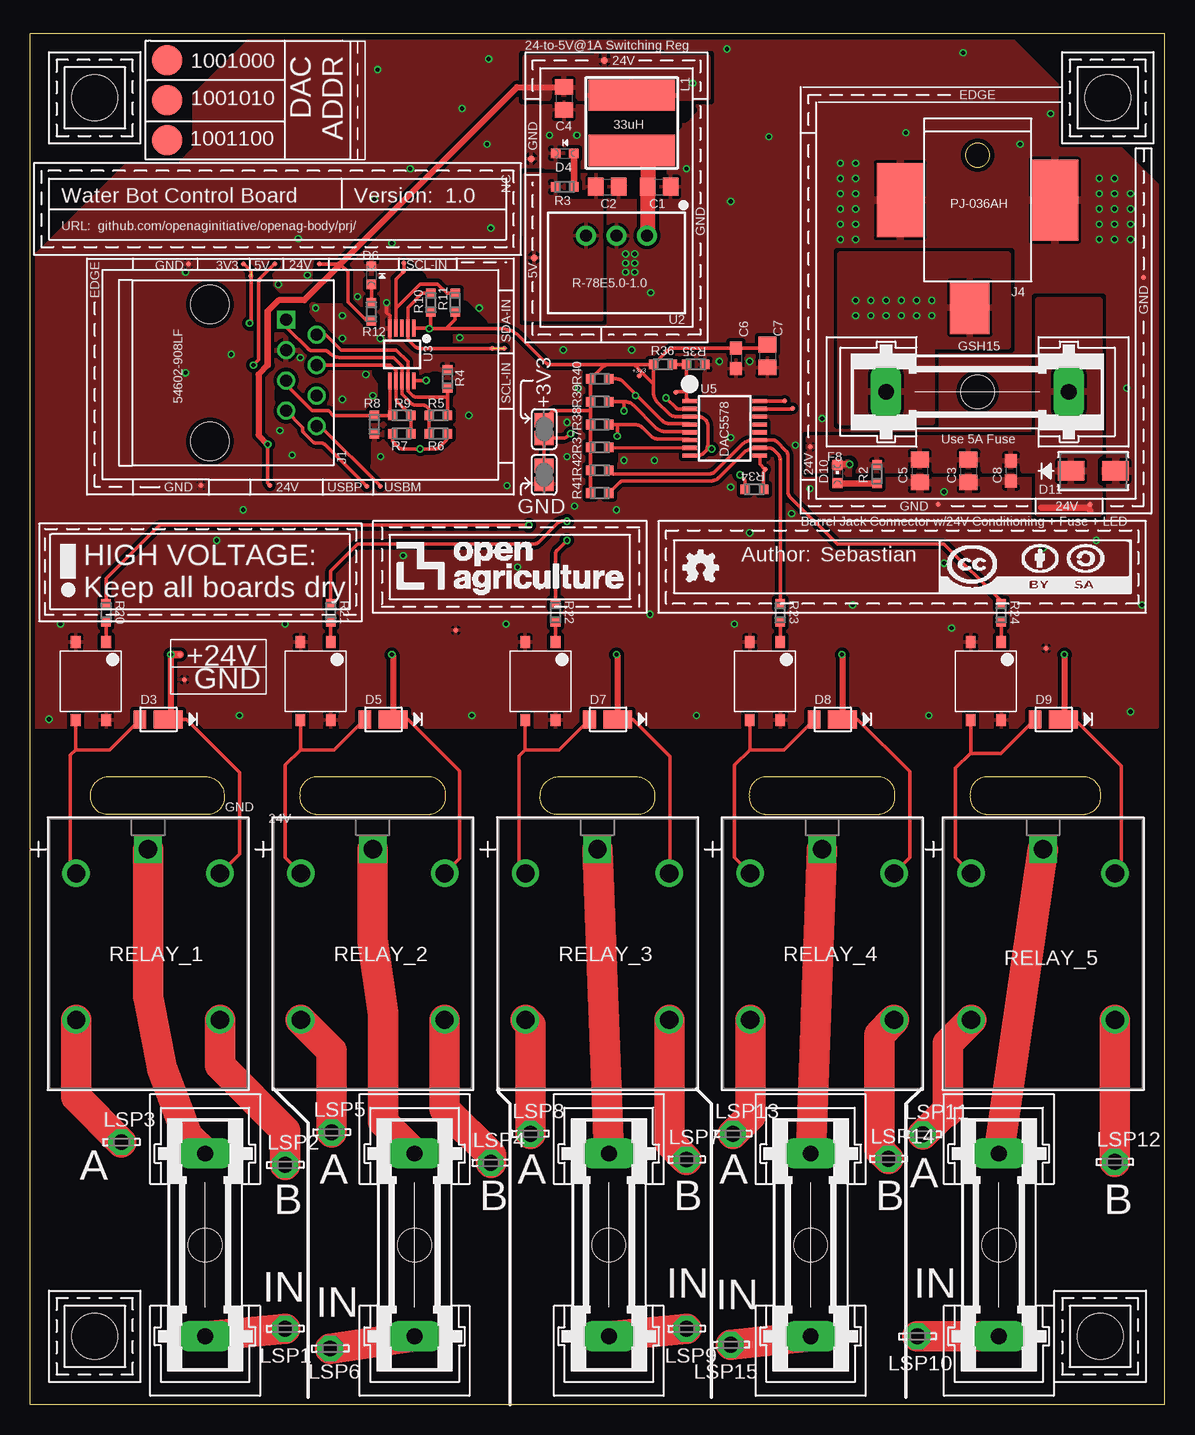
[diagram p2: board, top side]
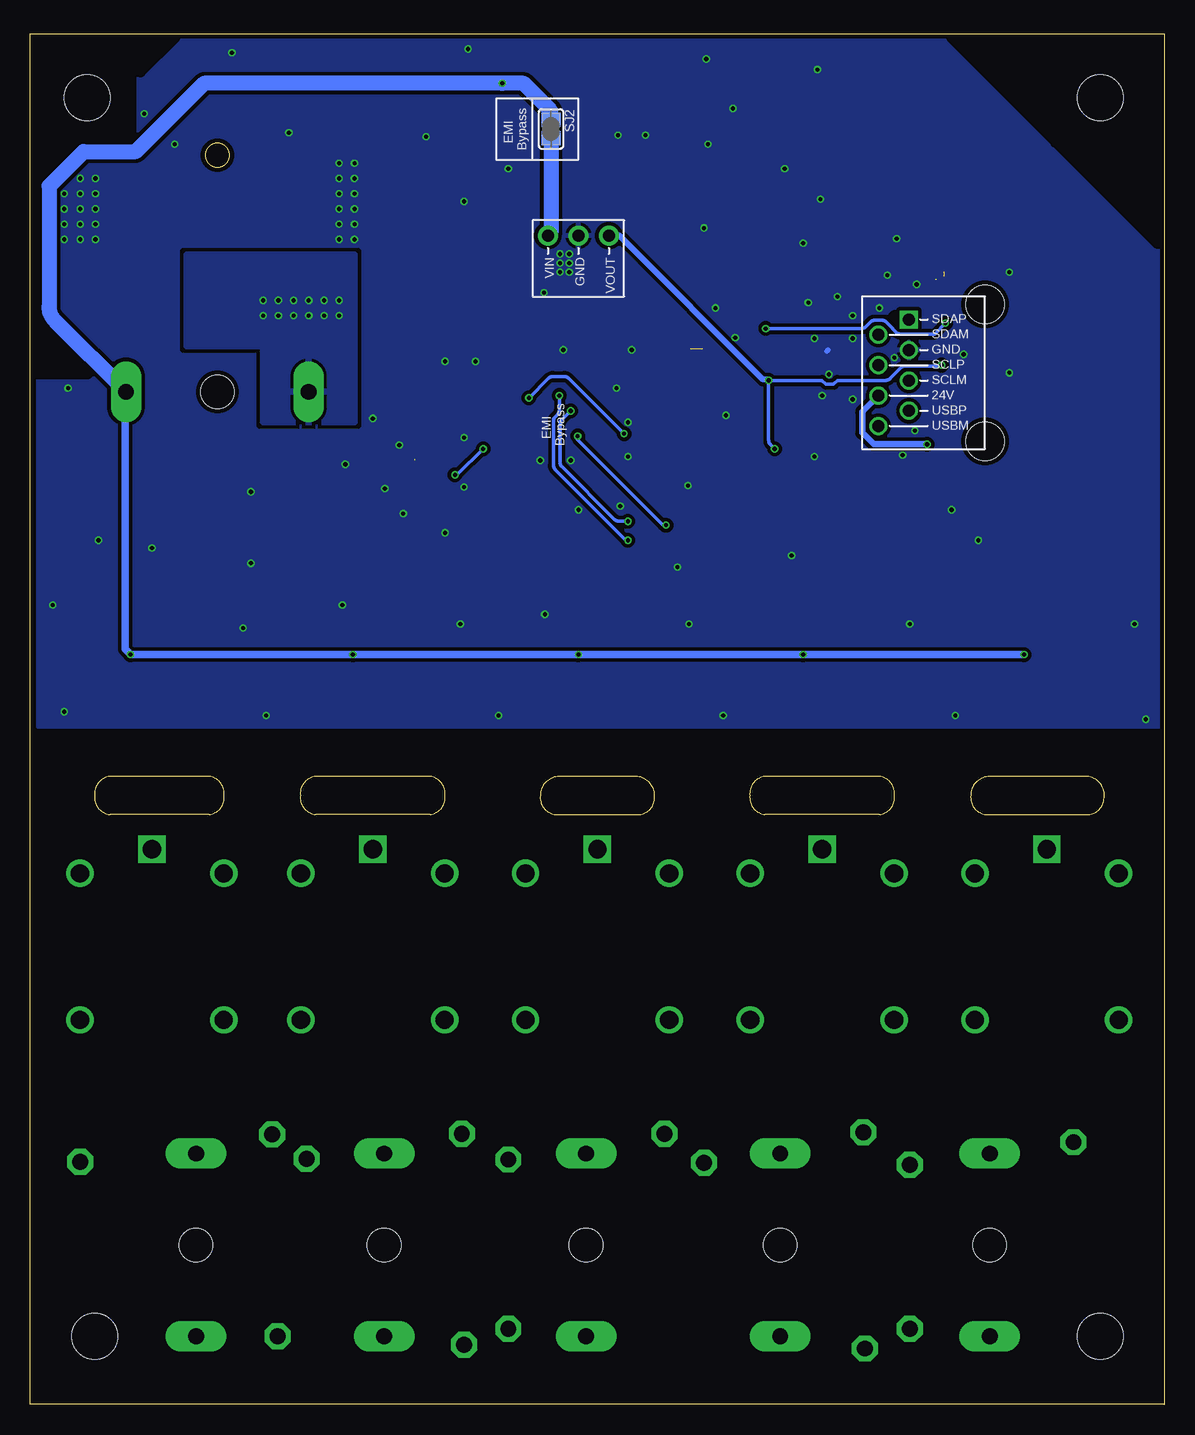
[diagram p3: board, bottom side, seen from below]

Size 94.62 x 114.3 mm. Coordinates in mm from the lower left corner, seen from the top.
Outline: 0,0.06 94.62,0.06 94.62,114.3 0,114.3 0,0
Outline: 6.67,49.21 arc-90 5.08,50.48 arc-90 6.35,52.39 14.61,52.39 arc-90 16.19,50.8 arc-90 14.92,49.21 6.67,49.21
Outline: 23.81,49.21 arc-90 22.54,50.8 arc-90 23.81,52.39 33.34,52.39 arc-90 34.61,50.8 arc-90 33.34,49.21 23.81,49.21
Outline: 43.82,49.21 arc-90 42.55,50.8 arc-90 44.13,52.39 50.48,52.39 arc-90 52.07,50.8 arc-90 50.8,49.21 43.82,49.21
Outline: 61.28,49.21 arc-90 60.01,50.8 arc-90 61.28,52.39 70.8,52.39 arc-90 72.07,50.8 arc-90 70.8,49.21 61.28,49.21
Outline: 79.69,49.21 arc-90 78.42,50.8 arc-90 79.69,52.39 87.95,52.39 arc-90 89.22,50.8 arc-90 87.95,49.21 79.69,49.21
Copper layers (1*16): Top 0.035559375mm / dielectric 1.6mm / Bottom 0.035559375mm
Design rules "oshpark-2layer-mask *": minimum track width 6mil, minimum drill 10mil, track to track 6mil, track to pad 6mil, pad to pad 6mil, via to via 6mil, smd to smd 6mil, copper to edge 15mil, drill to drill 6mil, minimum pad ring 5mil, minimum via ring 5mil, stop-mask expansion 2.5mil, vias tented up to drill 14mil, thermal gap 10mil
tRestrict: 32 lines
bRestrict: 4 lines

### Footprints (pad centres in the part's own frame; a part is rotated, then mirrored left to right if it is on the bottom)
C0805 = smd 1.3 x 1.5: 1 -0.95,0; 2 0.95,0
C0603 = smd 1.1 x 1: 1 -0.85,0; 2 0.85,0
POWERDI123 = smd 1.05 x 1.5: + -1.3,0 | smd 2.4 x 1.5: - 1.05,0
CHIPLED_0603 = smd 0.8 x 0.8: A 0,-0.75; C 0,0.75
SMA = smd 2.18 x 1.63: 1 -1.857,0; 2 1.857,0
GSH15 = drill 1.321 pad 2.54 long: 1 -7.62,0; 2 7.62,0 | hole 2.794: 0,0
RJ45-DI2C-USB-54602-908LF = drill 1: 24V(6) 1.905,8.89; DSCLM(5) 0.635,6.35; DSCLP(4) -0.635,8.89; DSDAM(2) -3.175,8.89; GND(3) -1.905,6.35; USBM(8) 4.445,8.89; USBP(7) 3.175,6.35 | drill 1 square: DSDAP(1) -4.445,6.35 | hole 3.2: -5.715,0; 5.715,0
BARREL-JACK-PJ-036AH = smd 4.4 x 3.3: 1 2.2,-0.65 | smd 6.75 x 3.9: 2 -6.75,6.45 | smd 6.2 x 3.9: 3 -6.75,-6.45
29333C = smd 2.6 x 7.2: 1 -2.3,0; 2 2.3,0
LSP13 = drill 1.321 pad 2.159 octagon: MP 0,0
RC0603N = smd 0.756 x 0.8: 1 -0.778,0; 2 0.778,0
RELAY_G5LE-1 = drill 1.524 pad 2.032 square: 1 0,17.424 | drill 1.524 pad 2.032: 2 -5.994,15.418; 3 -5.994,3.2; 4 5.994,3.2; 5 5.994,15.418
EMI-BYPASS = smd 1.168 x 1.6: 1 -0.762,0.254; 2 0.762,0.254
SJ1 = smd 1.168 x 1.6: 1 -0.762,0; 2 0.762,0
B2,54 = smd 2.54 x 2.54: TP 0,0
TP06R = smd 0.6 x 0.6: TP 0,0
TP04R = smd 0.4 x 0.4: 1 0,0
R-78E5.0-1.0 = drill 1 pad 1.676: 1 -2.54,0; 2 0,0; 3 2.54,0
SOP50P490X110-10N = smd 1.4 x 0.3: 1 -2.2,1; 2 -2.2,0.5; 3 -2.2,0; 4 -2.2,-0.5; 5 -2.2,-1; 6 2.2,-1; 7 2.2,-0.5; 8 2.2,0; 9 2.2,0.5; 10 2.2,1
TSSOP16 = smd 0.35 x 1.2: 1 -2.275,-2.925; 2 -1.625,-2.925; 3 -0.975,-2.925; 4 -0.325,-2.925; 5 0.325,-2.925; 6 0.975,-2.925; 7 1.625,-2.925; 8 2.275,-2.925; 9 2.275,2.925; 10 1.625,2.925; 11 0.975,2.925; 12 0.325,2.925; 13 -0.325,2.925; 14 -0.975,2.925; 15 -1.625,2.925; 16 -2.275,2.925
CORNER = hole 3.81: 0,0
LTV-355T = smd 0.8 x 1: N1 -1.27,-3.25; N2 1.27,-3.25; N3 -1.27,3.25; N4 1.27,3.25

### Placement (x,y rotation side)
C1  52.45,101.54 0 top
C2  48.13,101.54 0 top
C3  78.23,77.85 270 top
C4  44.51,108.9 270 top
C5  74.17,77.85 270 top
C6  58.86,87.25 270 top
C7  61.47,87.44 270 top
C8  81.79,77.85 270 top
D3  10.48,57.15 0 top
D4  44.58,104.33 90 top
D5  29.21,57.15 0 top
D6  28.46,94.17 0 top
D7  47.94,57.15 0 top
D8  66.67,57.15 0 top
D9  85.09,57.15 0 top
D10  67.31,77.6 0 top
D11  88.65,77.85 0 top
F2  14.61,13.33 90 top
F3  32.07,13.33 90 top
F4  48.26,13.33 90 top
F5  65.09,13.33 90 top
F6  80.77,13.33 90 top
F8  78.99,84.45 0 top
F9  75.95,80.14 0 top
J1  15,86.04 270 top
J4  78.99,93.68 270 top
L1  50.16,106.87 270 top
LSP1  21.27,6.35 0 top
LSP2  21.27,20 0 top
LSP3  7.62,21.91 0 top
LSP4  38.42,20.19 0 top
LSP5  25.15,22.73 0 top
LSP6  25.02,4.7 0 top
LSP7  54.74,20.45 0 top
LSP8  41.72,22.61 0 top
LSP9  54.74,6.35 0 top
LSP10  73.98,5.71 0 top
LSP11  74.42,22.54 0 top
LSP12  90.42,20.26 0 top
LSP13  58.61,22.61 0 top
LSP14  71.56,20.51 0 top
LSP15  58.42,5.02 0 top
R2  70.61,77.6 90 top
R3  44.58,101.54 180 top
R4  34.81,85.53 90 top
R5  34.05,82.49 0 top
R6  34.05,80.96 180 top
R7  31,80.96 180 top
R8  28.71,81.72 90 top
R9  31,82.49 0 top
R10  33.41,91.88 270 top
R11  35.45,91.88 270 top
R12  28.46,91.12 270 top
R20  6.35,66.04 270 top
R21  25.08,66.04 270 top
R22  43.82,66.04 270 top
R23  62.55,66.04 270 top
R24  80.96,66.04 270 top
R34  60.39,76.33 0 top
R35  55.5,86.74 180 top
R36  52.77,86.74 0 top
R37  47.5,79.82 180 top
R38  47.5,81.72 180 top
R39  47.5,83.63 180 top
R40  47.5,85.53 180 top
R41  47.5,76.01 180 top
R42  47.5,77.91 180 top
RELAY_1  9.84,28.89 0 top
RELAY_2  28.57,28.89 0 top
RELAY_3  47.31,28.89 0 top
RELAY_4  66.04,28.89 0 top
RELAY_5  84.45,28.89 0 top
SJ2  51.44,106.36 270 bottom
SJ_A1  42.86,81.34 270 top
SJ_A2  42.86,77.53 90 top
TP1  11.43,112.08 0 top
TP2  42.04,95.63 180 top
TP3  11.43,108.78 0 top
TP4  47.88,112.08 180 top
TP5  41.78,103.89 180 top
TP6  18.43,94.11 0 top
TP7  19.13,93.79 0 top
TP8  14.24,76.64 0 top
TP9  20.02,76.64 0 top
TP10  39.56,88.07 0 top
TP11  31.18,95.19 0 top
TP12  11.43,105.41 0 top
TP13  28.07,76.58 0 top
TP14  29.21,76.58 0 top
TP15  17.79,95.12 0 top
TP16  20.4,95.12 0 top
TP17  24.14,95.12 0 top
TP18  13.22,95.12 0 top
TP19  31.13,94.49 0 top
TP20  38.56,88.07 0 top
TP24  88.39,75.06 0 top
TP25  75.69,75.06 0 top
TP26  92.84,93.98 0 top
TP27  65.02,79.88 0 top
TP29  12.51,62.55 270 top
TP30  50.8,85.79 270 top
TP31  12.89,60.45 90 top
TP35  63.56,83.06 270 top
TP36  62.93,83.69 270 top
TP37  53.85,84.39 270 top
TP38  61.28,77.98 270 top
TP39  35.5,64.58 180 top
TP40  84.71,63.06 0 top
U2  48.9,97.47 180 top
U3  31,87.57 270 top
U5  57.91,81.41 270 top
U$1  [CORNER]  5.4,5.71 0 top
U$2  [CORNER]  5.4,108.95 270 top
U$3  [CORNER]  89.85,108.95 180 top
U$4  [CORNER]  89.22,5.71 90 top
U$5  [LOGO]  28.57,66.04 0 top
U$6  52.39,66.04 0 top
U$7  0.32,95.88 0 top
U$10  5.08,60.32 180 top
U$11  23.81,60.32 180 top
U$12  42.55,60.32 180 top
U$13  61.28,60.32 180 top
U$14  79.69,60.32 180 top

### Tracks (layer width: path | path; a pad name or v marks a point on that pad's centre or on a via)
24V_EMI
  Top 1.27: U2.1 51.5,97.54 C1.1 51.5,103.23 arc90 L1.2
  Bottom 1.27: SJ2.2 51.18,97.73 U2.1
24V_IN1  (via drill 0.35)
  other vias: 75.18,92.07 75.18,90.8 73.91,92.07 73.91,90.8 72.64,92.07 72.64,90.8 71.37,92.07 70.1,92.07 70.1,90.8 71.37,90.8 68.83,90.8 68.83,92.07
  pour Bottom (isolate 0.406): 75.18,81.91 67.56,81.91 67.56,95.88 81.53,95.88 81.53,88.27 75.18,88.27
  pour Top (isolate 0.406): 67.56,81.91 75.18,81.91 75.18,88.27 81.53,88.27 81.53,95.88 67.56,95.88
!LDAC!
  Top 0.305: R36.2 R35.2 54.72,84.46 | 54.72,84.46 54.72,83.95 U5.1 | TP37.1 53.91,84.46 54.72,84.46
+3V3  (via drill 0.35)  (1 unrouted)
  Top 0.305: v33.29,89.73 33.41,89.85 R10.2 | v33.29,89.73 34.68,89.73 | R11.2 35.45,90.49 34.68,89.73 | U3.1 33.25,89.77 v33.29,89.73 | 46.72,82.87 R39.2 R40.2 47.63,86.44 arc-45 48.35,86.74 | 46.72,82.87 R38.2 R37.2 R42.2 R41.2 | 56.52,80.11 56.52,81.6 arc45 56.29,82.14 arc45 55.71,82.38 U5.3 53.93,82.38 arc-45 53.21,82.68 52.29,83.6 arc-45 51.99,84.32 51.99,85.09 | 56.52,80.11 56.52,80.01 | 56.52,80.01 56.52,79.69 56.22,79.39 | 56.52,80.01 v56.83,79.69 | R34.1 59.61,77.1 v59.18,77.53 | C7.1 61.18,88.1 C6.1 53.77,88.1 arc45 53.05,87.8 R36.1 | 46.72,82.87 43.62,82.87 SJ_A1.1 | 50.8,85.73 TP30.1 50.97,85.96 arc-45 51.08,86 | 51.99,85.09 R36.1 | R36.1 50.16,86.74 | 50.16,86.74 48.35,86.74 | U5.8 55.61,79.13 arc45 56.2,79.37 56.22,79.39 | 56.22,79.39 arc45 56.52,80.11 | 51.99,85.09 51.08,86 | 51.08,86 50.46,86.62 arc45 50.16,86.74 | 34.68,89.73 39.29,89.73 arc-45 40.73,89.13 42.97,86.89 arc45 43.33,86.74 48.35,86.74 | v18.3,90.17 18.43,90.3 18.43,94.49 TP15.1
  Bottom 0.305: v56.83,79.69 58.99,77.53 v59.18,77.53 | v33.29,89.73 25.3,89.73 arc-45 24.94,89.87 24.54,90.28 arc45 24.18,90.42 23.6,90.42 arc45 23.24,90.28 22.68,89.72 22.68,89.67 22.44,89.43 arc-45 22.08,89.28 19.19,89.28 v18.3,90.17
+5V  (via drill 0.35)  (1 unrouted)
  Top 0.305: v33.03,85.41 32.99,85.37 U3.10 | R7.2 30.22,80.51 arc45 30.35,80.2 30.71,79.84 arc45 31.07,79.69 v32.52,79.69 33.76,79.69 arc45 34.12,79.84 34.68,80.4 arc45 34.83,80.76 R6.1 | TP16.1 19.06,93.79 19.06,87.12 v18.62,86.68
  Bottom 0.305: v18.62,86.68 18.68,86.61 21.64,86.61 arc-45 22,86.47 22.91,85.56 arc45 23.27,85.41 27.3,85.41 27.62,85.09 28.26,85.09 28.57,85.41 v33.03,85.41 33.03,80.41 arc-45 32.88,80.05 v32.52,79.69
  Bottom 0.508: U2.3 45.48,97.47 33.49,85.49 33.11,85.49 v33.03,85.41
  pour Top (isolate 0.305): 41.28,90.49 41.28,102.55 47.62,102.55 47.62,90.49
  pour Top (isolate 0.406): 42.55,102.55 41.28,102.55 41.28,97.47 42.55,97.47
+24V  (via drill 0.35)
  Top 0.305: TP9.1 19.82,76.84 v19.82,80.07 | R12.2 28.29,90.34 arc-45 27.93,90.49 26.5,91.93 26.5,94.47 25.85,95.12 | TP24.1 88.39,74.55 | 25.9,95.12 25.85,95.12 | 25.85,95.12 TP17.1 | RELAY_1.5 17.46,45.94 17.46,52.74 13.05,57.15 11.75,57.15 D3.- 11.75,57.37 v11.75,62.55 | RELAY_2.5 35.81,45.55 35.81,52.87 31.53,57.15 D5.- | RELAY_3.5 53.34,44.35 53.34,54.07 50.26,57.15 D7.- | RELAY_4.5 73.34,45.62 73.34,52.8 69,57.15 D8.- | RELAY_5.5 91,44.86 91,53.25 87.09,57.15 D9.-
  Top 0.508: 19.82,91.18 20.72,92.07 22.86,92.07 25.9,95.12 | 19.82,86.68 19.05,85.9 19.05,80.85 v19.82,80.07 | 25.85,95.12 40.59,109.85 C4.1 | v67.69,62.55 67.72,62.51 D8.- | v48.9,62.55 48.99,62.45 D7.- | v30.16,62.55 30.26,62.45 D5.- | v11.75,62.55 11.75,57.15 | v86.23,62.55 86.23,57.24 D9.-
  Top 0.559: 19.82,86.68 19.82,91.18 | 84.33,74.8 88.14,74.8 88.39,74.55
  Top 0.61: TP29.1 v11.75,62.55
  Bottom 0.559: v19.82,80.07 v19.83,80.08 24.25,80.08 25.22,81.04 25.22,82.79 23.89,84.12 J1.24V(6)
  Bottom 0.61: v11.75,62.55 v30.16,62.55 v48.9,62.55 v67.69,62.55 v86.23,62.55 86.68,62.99 86.68,84.39 F8.2
  Bottom 1.27: SJ2.1 51.18,107.89 53.47,110.17 v55.25,110.17 80.11,110.17 85.79,104.49 90.14,104.49 93.03,101.6 93.03,91.53 arc-45 92.56,90.4 F8.2
  pour Top (isolate 0.406): 41.28,108.9 41.28,112.39 56.52,112.39 56.52,108.9
  pour Top (isolate 0.406): 47.12,112.46 52.45,112.46 52.45,111.7 47.12,111.7
  pour Top (isolate 0.406): 89.15,74.3 89.15,92.07 84.07,92.07 84.07,74.3
  pour Top (isolate 0.406): 84.58,80.64 84.58,77.85 64.9,77.85 64.9,80.64
ADDR0  (via drill 0.35)
  Top 0.305: SJ_A2.2 SJ_A1.2 44.28,80.58 arc45 45,80.88 v45.09,80.96 | U5.2 54.02,83.03 arc-45 53.88,83.09 v53.02,83.95
  Bottom 0.305: v45.09,80.96 49.7,85.58 arc-45 50.06,85.73 51.03,85.73 arc-45 51.39,85.58 v53.02,83.95
DAC_!CLR!
  Top 0.305: U5.9 60.84,78.42 TP38.1 61.28,77.89 61.17,77.78 R34.2
DIM1
  Top 0.305: U5.7 R37.1
DIM2  (via drill 0.35)
  Top 0.305: U5.6 54.92,80.5 52.45,80.5 arc-45 51.74,80.8 51.11,81.43 arc45 50.39,81.72 48.96,81.72 | 48.96,81.72 R38.1 | 48.96,81.72 v48.96,80.77 | R20.1 6.35,68.9 10.65,73.19 arc-45 11.01,73.34 v41.59,73.34
  Bottom 0.305: v48.96,80.77 48.96,80.45 41.85,73.34 v41.59,73.34
DIM3  (via drill 0.35)
  Top 0.305: U5.5 54.92,81.15 52.91,81.15 arc-45 52.19,81.45 50.31,83.33 arc45 49.59,83.63 49.53,83.63 | 49.53,83.63 R39.1 | 49.53,83.63 v49.53,82.87 | v44.77,73.66 44.34,73.66 arc45 43.98,73.51 42.38,71.9 arc-45 42.02,71.75 27.3,71.75 25.08,69.53 R21.1
  Bottom 0.305: v49.53,82.87 50.27,82.13 arc-45 50.42,81.77 50.42,78.57 arc-45 50.27,78.21 45.87,73.81 arc-45 45.51,73.66 v44.77,73.66
DIM4  (via drill 0.35)
  Top 0.305: U5.4 54.92,81.8 53.37,81.8 arc-45 52.65,82.1 50.48,84.27 | R40.1 48.9,85.53 arc-45 49.44,85.31 50.48,84.27 | 50.48,84.27 v50.48,84.14 | v44.77,72.07 43.96,71.27 arc45 43.82,70.91 R22.1
  Bottom 0.305: v44.77,72.07 44.92,72.07 50.83,77.98 arc45 50.98,78.34 50.98,82 | 50.98,82 50.98,82.21 50.83,82.36 | v50.48,84.14 50.48,82.92 arc45 50.63,82.56 50.83,82.36 | 50.83,82.36 arc-45 50.98,82
DIM5  (1 unrouted)
  Top 0.305: 62.55,78.85 arc45 62.4,79.21 61.97,79.63 arc45 61.61,79.78 U5.10 60.56,79.78 arc45 59.45,79.32 57.43,77.3 arc-45 56.76,77.03 49.5,77.03 arc45 49.14,76.88 R41.1 | R23.1 62.55,78.77 62.51,78.81
DIM6
  Top 0.305: R42.1 48.59,77.6 56.6,77.6 arc45 57.11,77.81 59.34,80.04 arc-45 60.28,80.43 U5.11 61.91,80.43 arc-45 62.27,80.28 63.03,79.52 arc-45 63.18,79.16 63.18,76.09 arc45 63.33,75.73 67.31,71.75 76.2,71.75 80.96,66.99 R24.1
DSCLM_1
  Top 0.305: 28.73,82.49 R9.1 30.13,82.52 30,82.65 U3.6 | 28.73,82.49 R8.2 | 21.39,85.37 J1.DSCLM(5) 21.33,85.39 21.33,85.06 23.51,82.88 24.88,82.88 25.27,82.49 28.73,82.49
DSCLP_1
  Top 0.305: R7.1 R9.2 30.65,83.62 arc-45 30.5,83.97 U3.7 30.5,86.21 30.04,86.68 J1.DSCLP(4)
DSDAM_1
  Top 0.305: R5.2 34.83,84.01 | 34.83,84.01 34.83,84.49 R4.1 | 24.24,89.22 J1.DSDAM(2) 24.66,89.22 25.93,87.95 30.52,87.95 31.5,86.97 U3.9 31.5,84.53 31.87,84.16 arc45 32.23,84.01 34.83,84.01
DSDAP_1
  Top 0.305: R6.2 R5.1 33.27,83.01 33.06,83.22 arc45 32.77,83.34 32.13,83.34 arc-45 31.77,83.49 31,84.26 U3.8 31,86.61 30.3,87.31 25.86,87.31 arc-45 24.96,87.69 24.91,87.74 arc45 24.55,87.88 23.53,87.88 arc-45 23.17,88.03 21.5,89.7 arc-45 21.35,90.06 J1.DSDAP(1)
GND  (via drill 0.35)
  Top 0.305: v29.73,91.88 29.73,91.06 30,90.79 U3.5 30,88.74
  Top 0.559: D10.C 67.37,78.41 v68.33,78.41
  Bottom 0.406: 28.08,87.95 28.21,87.82
  other vias: 45.59,105.85 54.74,103.06 49.66,95.95 49.66,95.19 50.42,95.19 50.42,95.95 49.66,94.42 50.42,94.42 43.31,105.85 12.97,86.04 36.59,82.49 12.97,94.42 23.13,94.17 31.7,103.06 29.22,79.06 38.24,112.2 36.02,108.08 35.83,88.96 20.84,81.22 22.36,97.22 16.78,87.57 21.86,79.18 28.71,100.52 28.97,111.32 39.76,76.64 58.42,80.64 49.53,78.74 57.47,87 50.16,87.95 60.01,87 45.72,84.77 44.77,79.06 48.9,74.61 66.04,82.23 52.07,78.74 60.01,72.71 63.82,80.01 22.54,87.31 26.04,88.9 29.21,88.9 26.04,90.8 68.83,103.5 68.83,102.23 68.83,100.97 68.83,99.69 68.83,98.42 68.83,97.16 67.56,97.16 67.56,98.42 67.56,99.69 67.56,100.97 67.56,102.23 67.56,103.5 89.15,102.23 89.15,100.97 89.15,99.69 89.15,98.42 89.15,97.16 90.42,97.16 90.42,98.42 90.42,99.69 90.42,100.97 90.42,102.23 76.2,76.12 65.02,76.38 63.5,74.3 76.2,70.17 58.42,76.52 45.4,74.93 31.11,70.8 40.64,69.85 51.69,65.91 61.59,105.73 58.42,100.33 77.79,112.71 85.09,107.63 73.03,106.04 44.77,81.91 26.04,83.82 28.57,84.14 28,85.92 91.76,100.97 91.76,99.69 91.76,98.42 91.76,97.16 38.42,98.11 37.47,91.44 44.45,87.95 51.75,92.71 30.16,96.84 38.1,105.09 23.81,91.44 20.7,93.41 27.3,92.39 58.1,113.03 82.55,105.09 68.58,66.67 1.59,57.15 17.46,57.47 36.83,57.47 55.56,57.47 74.93,57.47 91.76,57.78 76.84,64.77 58.74,65.09 39.69,65.09 21.27,65.09 2.54,65.09 15.56,72.07 17.78,74.61 92.71,66.67 84.45,71.44 88.9,72.07 91.44,84.77
  pour Top (isolate 0.305, rank 3): 0,56.52 93.98,56.52 93.98,113.66 0,113.66
  pour Bottom (isolate 0.305, rank 3): 0,56.52 93.98,56.52 93.98,113.98 0,113.98
  pour Top (isolate 0.305, rank 2): 41.28,88.58 41.28,112.71 56.52,112.71 56.52,88.58
  pour Bottom (isolate 0.406, rank 2): 56.52,88.58 56.52,112.71 41.28,112.71 41.28,88.58
  pour Top (isolate 0.305): 4.76,75.88 40.32,75.88 40.32,113.03 4.76,113.03
  pour Bottom (isolate 0.406): 40.64,75.88 40.64,113.03 4.76,113.03 4.76,75.88
  pour Top (isolate 0.305, rank 2): 64.26,74.3 64.26,110.17 93.47,110.17 93.47,74.3
  pour Bottom (isolate 0.406, rank 2): 64.26,110.17 93.47,110.17 93.47,74.3 64.26,74.3
N$4
  Top 2.54: F2.1 LSP1.MP
N$5
  Top 2.54: LSP15.MP F5.1
N$6
  Top 2.54: LSP10.MP F6.1
N$7
  Top 2.54: LSP6.MP F3.1
N$11
  Top 2.54: F4.1 LSP9.MP
N$27
  Top 2.54: LSP2.MP 21.27,22.86 15.84,28.3 RELAY_1.4
N$31
  Top 2.54: LSP4.MP 38.42,20.83 34.57,24.68 RELAY_2.4
N$32
  Top 2.54: LSP7.MP 53.3,21.88 RELAY_3.4
N$33
  Top 0.559: R3.1 45.36,104.3 D4.A
N$42
  Top 0.305: RELAY_1.2 3.37,44.79 3.37,54.17 3.81,54.61 | D3.+ 6.64,54.61 3.81,54.61 | 3.81,54.61 U$10.N4
  Top 0.508: 3.78,57 arc-45 U$10.N4
N$43
  Top 0.305: R12.1 D6.A
N$44
  Top 2.54: RELAY_1.1 9.84,34.07 11.01,28 13.16,22.4 F2.2
N$45
  Top 2.54: LSP3.MP 3.85,25.68 RELAY_1.3
N$46
  Top 2.54: RELAY_5.4 90.45,20.28 LSP12.MP
N$47
  Top 0.305: R20.2 U$10.N1
N$48
  Top 0.305: RELAY_2.2 21.27,45.62 21.27,53.34 22.54,54.61 | D5.+ 25.37,54.61 22.54,54.61 | 22.54,54.61 U$11.N4
N$49
  Top 2.54: RELAY_2.1 28.57,38.73 29.42,32.64 29.42,23.6 F3.2
N$50
  Top 2.54: RELAY_2.3 25.15,29.53 LSP5.MP
N$51
  Top 2.54: RELAY_4.4 70.8,30.86 70.8,21.27 LSP14.MP
N$52
  Top 0.305: R21.2 U$11.N1
N$53
  Top 0.305: RELAY_3.2 40.77,44.86 40.77,54.1 41.28,54.61 | D7.+ 44.1,54.61 41.28,54.61 | 41.28,54.61 U$12.N4
N$54
  Top 2.54: RELAY_3.1 F4.2
N$55
  Top 2.54: RELAY_3.3 41.72,31.69 LSP8.MP
N$57
  Top 0.305: R22.2 U$12.N1
N$58
  Top 0.305: RELAY_4.2 58.74,45.62 58.74,53.34 60.01,54.61 | D8.+ 62.84,54.61 60.01,54.61 | 60.01,54.61 U$13.N4
N$59
  Top 2.54: RELAY_4.1 F5.2
N$60
  Top 2.54: LSP13.MP 60.05,24.04 RELAY_4.3
N$61
  Top 0.559: D10.A 67.34,76.82 R2.1
N$62
  Top 0.305: R23.2 U$13.N1
N$63
  Top 0.305: RELAY_5.2 77.15,45.62 77.15,53.09 78.42,54.36 | 78.42,54.36 78.42,54.29 80.93,54.29 D9.+ | 78.42,54.36 78.42,56.76
  Top 0.508: 78.42,56.76 U$14.N4
N$64
  Top 2.54: RELAY_5.1 F6.2
N$65
  Top 2.54: RELAY_5.3 76.52,30.15 76.52,24.45 76.33,24.45 LSP11.MP
N$67
  Top 0.305: R24.2 U$14.N1
SCL
  Top 0.305: U5.16 TP36.1
SCL_IN
  Top 0.305: 30.5,91.44 30.5,93.86 TP19.1 31.18,94.54 TP11.1 | 30.5,91.44 U3.4 | 30.5,91.44 32.51,93.45 33.98,93.45 34.77,92.66 R11.1
SDA
  Top 0.305: U5.15 63.54,83.03 TP35.1
SDA_IN  (1 unrouted)
  Top 0.305: R10.1 32.7,92.66 31.5,91.46 U3.2 31.5,89.05 arc45 31.65,88.7 32.12,88.22 arc45 32.48,88.07 TP10.1
USBM
  Top 0.305: TP14.1 24.19,81.6 J1.USBM(8)
USBP
  Top 0.305: TP13.1 24.61,80.03 arc45 24.25,80.18 23.88,80.18 arc-45 23.52,80.33 22.88,80.97 arc-45 22.73,81.33 22.73,81.48 J1.USBP(7)

### Text on the board
tPlace: DAC / ADDR | 24-to-5V@1A Switching Reg | 24V | 1001000 | 1001010 | EDGE | 1001100 | GND | NC | GND | SCL-IN | GND | 3V3 | 5V | 24V | 5V | GND | EDGE | SDA-IN | SCL-IN | +3V3 | 24V | GND | USBM | 24V | USBP | GND | 24V | GND | Barrel Jack Connector w/24V Conditioning + Fuse + LED | HIGH VOLTAGE: / Keep all boards dry | +24V | GND | GND | 24V | A | A | A | A | A | B | B | B | B | B | IN | IN | IN | IN | IN
bPlace: EMI / Bypass
tNames: +3v3